# Altium schematic sheet GLV-Connectors.SchDoc
size A; SheetNumber: 2; SheetTotal: 8
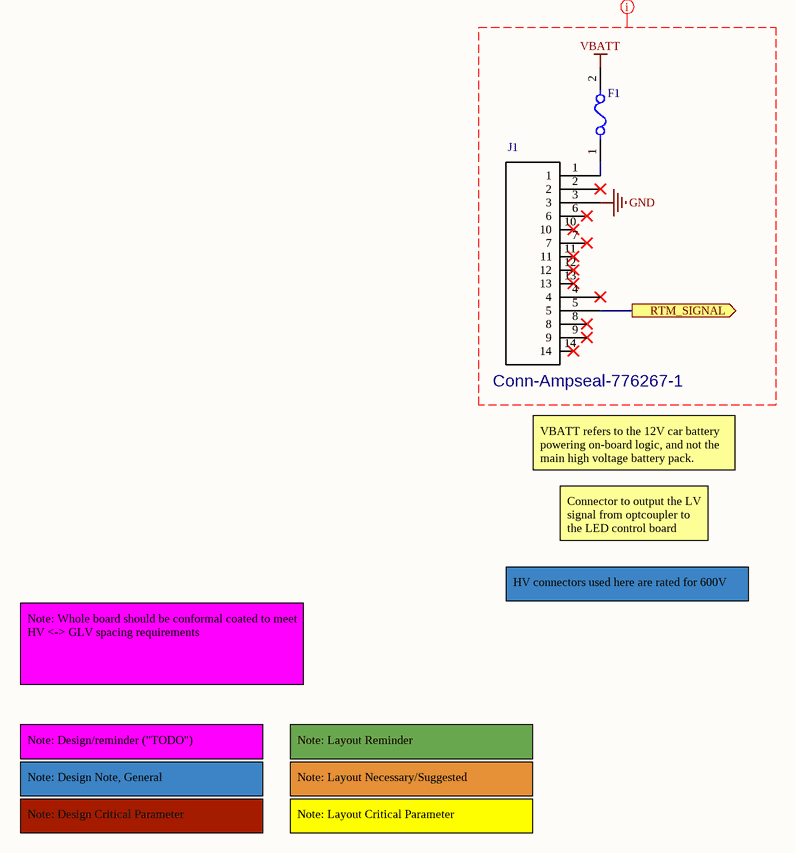
[diagram p0: GLV-Connectors.SchDoc]

## Parts
F1  0468003.NRHF  [FP-437-MFG]  (value not drawn)
J1  Conn-Ampseal-776267-1  [FOOTPRINT-AMPSEAL-776267-1]

## Ports
RTM_SIGNAL (out, see Top_Level[4B], Relay-Isolation[4B])

## Nets
GND: J1.3
VBATT: F1.2
RTM_SIGNAL: J1.5 ; port RTM_SIGNAL
NetF1_1: F1.1 J1.1

Not connected (* = marked no-connect by the designer): J1 2* 4* 6* 7* 8* 9* 10* 11* 12* 13* 14*

## Layout directives
mark named GLV plus LV RTML Connection: GND, VBATT

## Notes on the sheet
- VBATT refers to the 12V car battery powering on-board logic, and not the main high voltage battery pack.
- Connector to output the LV signal from optcoupler to the LED control board
- HV connectors used here are rated for 600V
- Note: Whole board should be conformal coated to meet HV <-> GLV spacing requirements
- Note: Design/reminder ("TODO")
- Note: Layout Reminder
- Note: Design Note, General
- Note: Layout Necessary/Suggested
- Note: Design Critical Parameter
- Note: Layout Critical Parameter

## Library data of the parts
F1 = CMP-08605-000049-1: FUSE BRD MNT 3A 32VAC 35VDC 1206; Manufacturer: Littelfuse Inc; Manufacturer Part Number: 0437003.WR; Fuse Interrupt Ac Current: 50A; Value: 0.033Ω; Fuse Blow Speed: Fast; Voltage Rating: 32V; Max Fuse Dc Voltage: 35V; Fuse I2T: 0.506A2Sec; Fuse Voltage Drop: 0.14V; Octopart: https://octopart.com/0437003.wr-littelfuse-8600121; Category: Fuse; Fuse Interrupt Dc Current: 50A; Temperature: -55°C to +150°C; Device Class L1: Circuit Protection; Fuse Current: 3A; Temperature Range High: +150°C; Temperature Range Low: -55°C; Resistance: 0.033Ω; Automotive: No; ComponentLink2URL: https://www.littelfuse.com/~/media/electronics/datasheets/fuses/littelfuse_fuse_437_datasheet.pdf.pdf; Ipc Land Pattern Name: CAPC320163X82; Mouser Description: Surface Mount Fuses 32V FA 1206 3A; Device Class L2: Fuses; Device Class L3: unset; Package: 437; RoHS: TRUE; Height: 0.8639mm; Digikey Description: FUSE BRD MNT 3A 32VAC 35VDC 1206; ComponentLink2Description: Datasheet; Lead Free: Yes; Max Fuse Ac Voltage: 32V
J1 = CMP-035-000002-1: AMPSEAL RA 14ckt Faced w/ Gasket Automotive; MF: TE Connectivity; Source: Connectors.SchLib; SnapEDA_Link: https://www.snapeda.com/parts/776267-1/TE%20Connectivity%20AMP%20Connectors/view-part/?ref=snap; Value: *; MP: 776267-1; Package: None; Availability: Unavailable; Price: None; Design Item ID: Conn-Ampseal-776267-1; TE_purchase_URL: https://www.te.com/usa-en/product-776267-1.html?te_bu=Cor&te_type=disp&te_campaign=seda_glo_cor-seda-global-disp-prtnr-fy19-seda-model-bom-cta_sma-317_1&elqCampaignId=32493; EU_RoHS_Compliance: Compliant